# Altium schematic sheet MicroSD.SchDoc
size A4
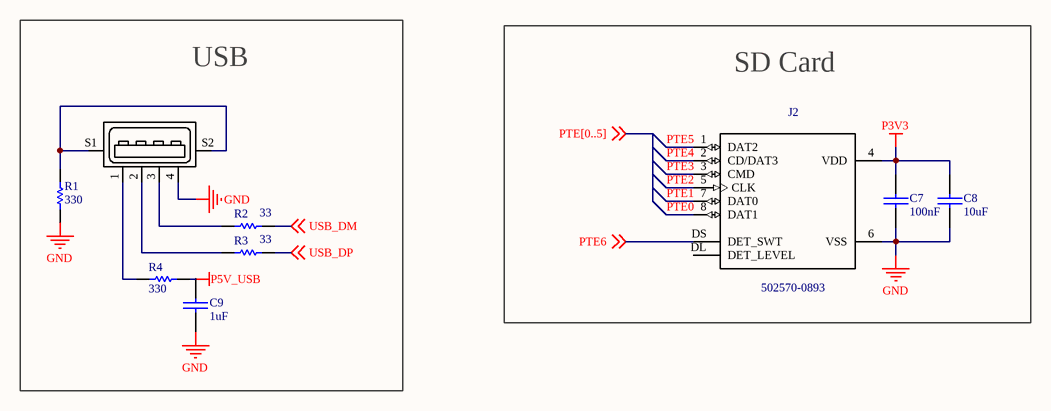
[diagram p0: MicroSD.SchDoc]

## Parts
C7  100nF  [0805]
C8  10uF  [0805]
C9  1uF  [0805]
J1  UJ2-AH-1-SMT  [CUI_UJ2-AH-1-SMT_UJ2-AH-1-SMT(Primary)]  (value not drawn)
J2  502570-0893  [MOLEX_502570-0893_502570-0893(Primary)]
R1  330  [0805]
R2  33  [0805]
R3  33  [0805]
R4  330  [0805]

## Blocks framed on the sheet
USB: C9 J1 R1-R4
SD Card: C7 C8 J2

## Nets
GND: C7.2 C8.2 C9.2 J1.4 J2.6(VSS) R1.1
P3V3: C7.1 C8.1 J2.4(VDD)
P5V_USB: R4.1
PTE0: J2.8(DAT1)
PTE1: J2.7(DAT0)
PTE2: J2.5(CLK)
PTE3: J2.3(CMD)
PTE4: J2.2(CD/DAT3)
PTE5: J2.1(DAT2)
PTE6: J2.DS(DET_SWT) ; off-sheet PTE6
USB_DM: R2.1 ; off-sheet USB_DM
USB_DP: R3.1 ; off-sheet USB_DP
NetJ1_1: J1.1 R4.2
NetJ1_2: J1.2 R3.2
NetJ1_3: J1.3 R2.2
NetJ1_S1: J1.S1(SHIELD) J1.S2(SHIELD) R1.2

Not connected (* = marked no-connect by the designer): C9 1; J2 DL(DET_LEVEL)

## Library data of the parts
C7-C9 = CAP
J1 = UJ2-AH-1-SMT: Standard A type 4 pin Horizontal 3 Âµin Plating SMT USB 2.0 Jack; MP: UJ2-AH-1-SMT-TR; MF: CUI Inc.; CUI_purchase_URL: https://www.cui.com/product/interconnect/usb-connectors/type-a/uj2-ah-smt-series?utm_source=snapeda.com&utm_medium=referral&utm_campaign=snapedaBOM; Package: None; Availability: Unavailable; SnapEDA_Link: https://www.snapeda.com/parts/UJ2-AH-1-SMT-TR/CUI%20Inc./view-part/?ref=snap; Price: None; Value: *
J2 = 502570-0893: 1.10mm Pitch microSD Memory Card Connector, Normal Mount Surface Mount, Push-Push Type; MF: Molex; Availability: Unavailable; Package: None; SnapEDA_Link: https://www.snapeda.com/parts/502570-0893/Molex/view-part/?ref=snap; MP: 502570-0893; Price: None; Value: *
R1-R4 = RES